# EAGLE design CC2-64K-EPROM-CARTRIDGE-2012-V1RA (EAGLE 5.10)
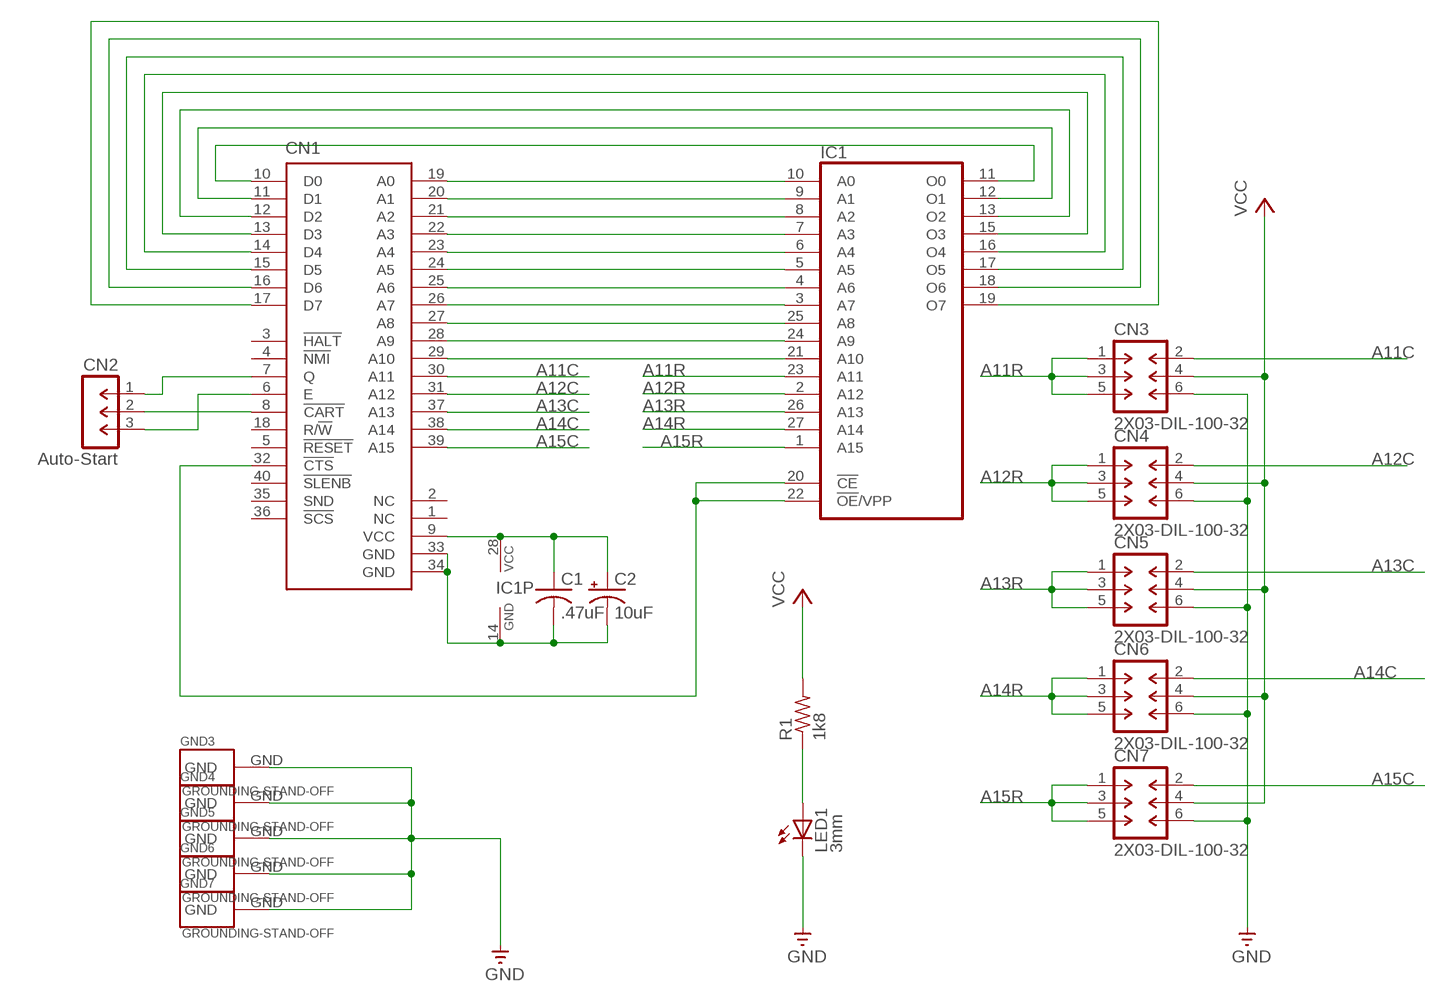
[diagram p0: schematic, sheet 1]

## Parts
C1  .47uF  NP-CAPACITOR-C050-025X075  [C050-025X075]
C2  10uF  P-CAPACITOR-CPOL-RADIAL-1  [CPOL-RADIAL-1]
CN1  COCO3-CARTRIDGE-PLUG-MEDIUM  [EDGE-CARD-PLUG-40-MEDIUM]
CN2  Auto-Start  1X03-SIP-100-32  [SIL1X03-100]
CN3  2X03-DIL-100-32  [DIL2X03-100]
CN4  2X03-DIL-100-32  [DIL2X03-100]
CN5  2X03-DIL-100-32  [DIL2X03-100]
CN6  2X03-DIL-100-32  [DIL2X03-100]
CN7  2X03-DIL-100-32  [DIL2X03-100]
GND3  GROUNDING-STAND-OFF  [STAND-OFF]
GND4  GROUNDING-STAND-OFF  [STAND-OFF]
GND5  GROUNDING-STAND-OFF  [STAND-OFF]
GND6  GROUNDING-STAND-OFF  [STAND-OFF]
GND7  GROUNDING-STAND-OFF  [STAND-OFF]
IC1  27C512D  [DIL28-6]
LED1  3mm  LED3MM  [LED3MM]
R1  1k8  RESISTOR  [0207/10]

## Nets
!CART: CN1.8(!CART) CN2.2
A11C: CN1.30(A11) CN3.2
A11R: CN3.1 CN3.3 CN3.5 IC1.23(A11)
A12C: CN1.31(A12) CN4.2
A12R: CN4.1 CN4.3 CN4.5 IC1.2(A12)
A13C: CN1.37(A13) CN5.2
A13R: CN5.1 CN5.3 CN5.5 IC1.26(A13)
A14C: CN1.38(A14) CN6.2
A14R: CN6.1 CN6.3 CN6.5 IC1.27(A14)
A15C: CN1.39(A15) CN7.2
A15R: CN7.1 CN7.3 CN7.5 IC1.1(A15)
E: CN1.6(E) CN2.3
GND [power]: C1.2(-) C2.2(-) CN1.33(GND) CN1.34(GND) CN3.6 CN4.6 CN5.6 CN6.6 CN7.6 GND3.GND GND4.GND GND5.GND GND6.GND GND7.GND IC1.14(GND) LED1.K(C)
N$1: CN1.19(A0) IC1.10(A0)
N$2: CN1.20(A1) IC1.9(A1)
N$3: CN1.21(A2) IC1.8(A2)
N$4: CN1.22(A3) IC1.7(A3)
N$5: CN1.23(A4) IC1.6(A4)
N$6: CN1.24(A5) IC1.5(A5)
N$7: CN1.25(A6) IC1.4(A6)
N$8: CN1.26(A7) IC1.3(A7)
N$9: CN1.27(A8) IC1.25(A8)
N$10: CN1.28(A9) IC1.24(A9)
N$11: CN1.29(A10) IC1.21(A10)
N$12: CN1.10(D0) IC1.11(O0)
N$13: CN1.11(D1) IC1.12(O1)
N$14: CN1.12(D2) IC1.13(O2)
N$15: CN1.13(D3) IC1.15(O3)
N$16: CN1.14(D4) IC1.16(O4)
N$17: CN1.15(D5) IC1.17(O5)
N$18: CN1.16(D6) IC1.18(O6)
N$19: CN1.17(D7) IC1.19(O7)
N$23: CN1.32(!CTS) IC1.20(!CE) IC1.22(!OE!/VPP)
N$24: LED1.A R1.1
Q: CN1.7(Q) CN2.1
VCC [power]: C1.1(+) C2.1(+) CN1.9(VCC) CN3.4 CN4.4 CN5.4 CN6.4 CN7.4 IC1.28(VCC) R1.2
Unconnected: CN1.1(NC) CN1.2(NC) CN1.3(!HALT) CN1.4(!NMI) CN1.5(!RESET) CN1.18(R/!W) CN1.35(SND) CN1.36(!SCS) CN1.40(!SLENB)

## Library data of the parts
C1 = GIMEchip-Capacitor:NP-CAPACITOR: NON-POLARIZED CAPACITOR grid 5mm
C2 = GIMEchip-Capacitor:P-CAPACITOR: POLARIZED CAPACITOR Small Radial Electrolytic
CN1 = GIMEchip-TRS-80-CoCo-3-Program-Pak-Cartridge:COCO3-CARTRIDGE-PLUG: CoCo 3 Program Pak Cartridge Plug - http://www.GIMEchip.com/ Tandy Radio Shack TRS-80 Color Computer 3 Program Pak Cartridge Plug (Edge-Card) E.A.G.L.E. Library Part created by John Eric Turner & His Father - sales@gimechip.com <mailto:sales@gimechip.com?subject=Tandy Radio Shack TRS- 80 Color Computer 3 Program Pak Cartridge Plug (Edge-Card) E.A.G.L.E. Library Part> 40-Pin Edge-Card sharing the same pinout as the Program Pak Cartridge Edge-Card Connector. This library part has been designed to provide a 40-pin cartridge plug connector matching the CoCo's Edge-Card connector (Cartridge Slot). This library part is also useful with the Dragon and other CoCo clones. It is important to note that the CoCo 2 & 3 only provide +5V at the cartridge connector. The CoCo 1 provides +5V AND +/-12V at the cartridge connector. The Dragon provides only +5V and +12V at the cartridge connector. The table below lists all similarities and differences between these machines, relevant to the cartridge slot: PIN # TRS-80 "CoCo 1" Function Tano/Dragon Data "Dragon 32/64" Function TRS-80 "CoCo 2 & 3" Function 1 -12V +12V NC 2 +12V +12V NC 3 HALT* HALT* HALT* 4 NMI* NMI* NMI* 5 RESET* RESET* RESET* 6 E E E 7 Q Q Q 8 CART* CART* CART* 9 +5V +5V +5V 10 D0 D0 D0 11 D1 D1 D1 12 D2 D2 D2 13 D3 D3 D3 14 D4 D4 D4 15 D5 D5 D5 16 D6 D6 D6 17 D7 D7 D7 18 R/W* R/W* R/W* 19 A0 A0 A0 20 A1 A1 A1 21 A2 A2 A2 22 A3 A3 A3 23 A4 A4 A4 24 A5 A5 A5 25 A6 A6 A6 26 A7 A7 A7 27 A8 A8 A8 28 A9 A9 A9 29 A10 A10 A10 30 A11 A11 A11 31 A12 A12 A12 32 CTS* CSEL* CTS* 33 GND GND GND 34 GND GND GND 35 SND SND SND 36 SCS* P2* SCS* 37 A13 A13 A13 38 A14 A14 A14 39 A15 A15 A15 40 SLENB* DSD* SLENB*
CN2 = GIMEchip-Header-Generic:1X03: MALE HEADER
CN3-CN7 = GIMEchip-Header-Generic:2X03: MALE HEADER
GND3-GND7 = GIMEchip-Grounding:GROUNDING
IC1 = GIMEchip-EPROM:27C512D: MEMORY
LED1 = Copy of GCC-CC3-512KCBR-0001:LED3MM: LED T1 (3 mm)
R1 = GIMEchip-Resistor:RESISTOR

## Net classes
0 default: width 0.254 mm, clearance 0.203 mm
1 power: width 0.635 mm, clearance 0.203 mm

## Board
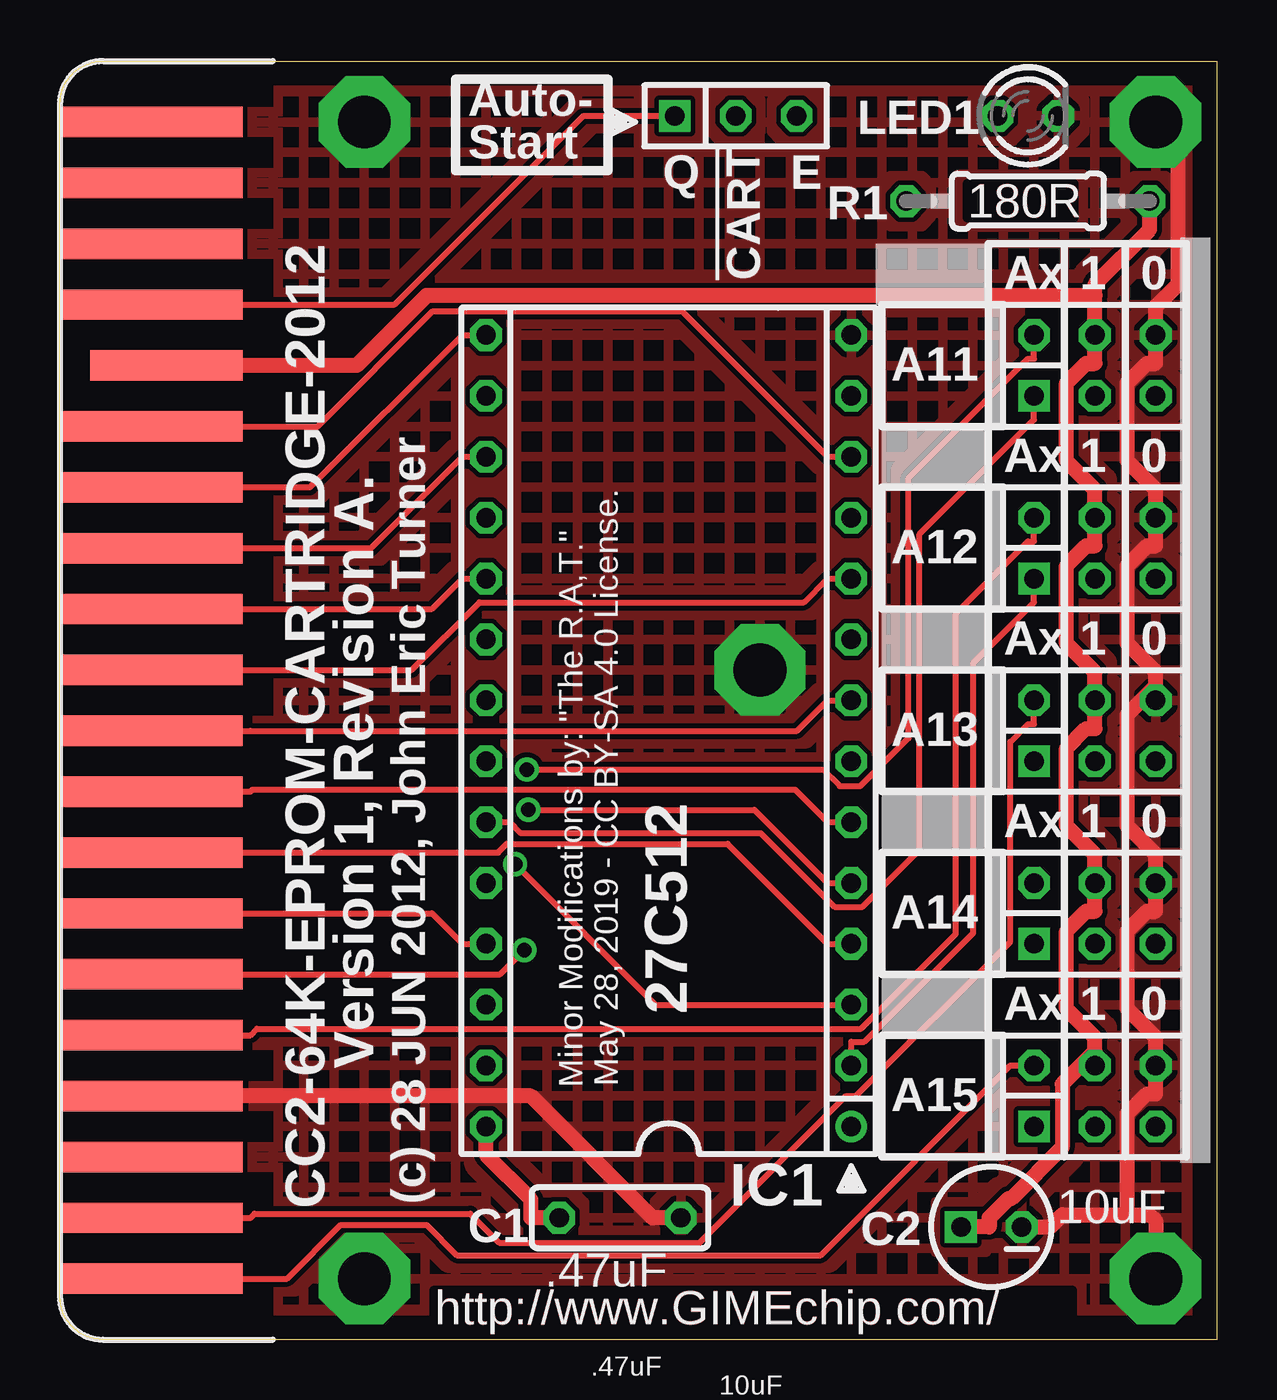
[diagram p1: board, top side]
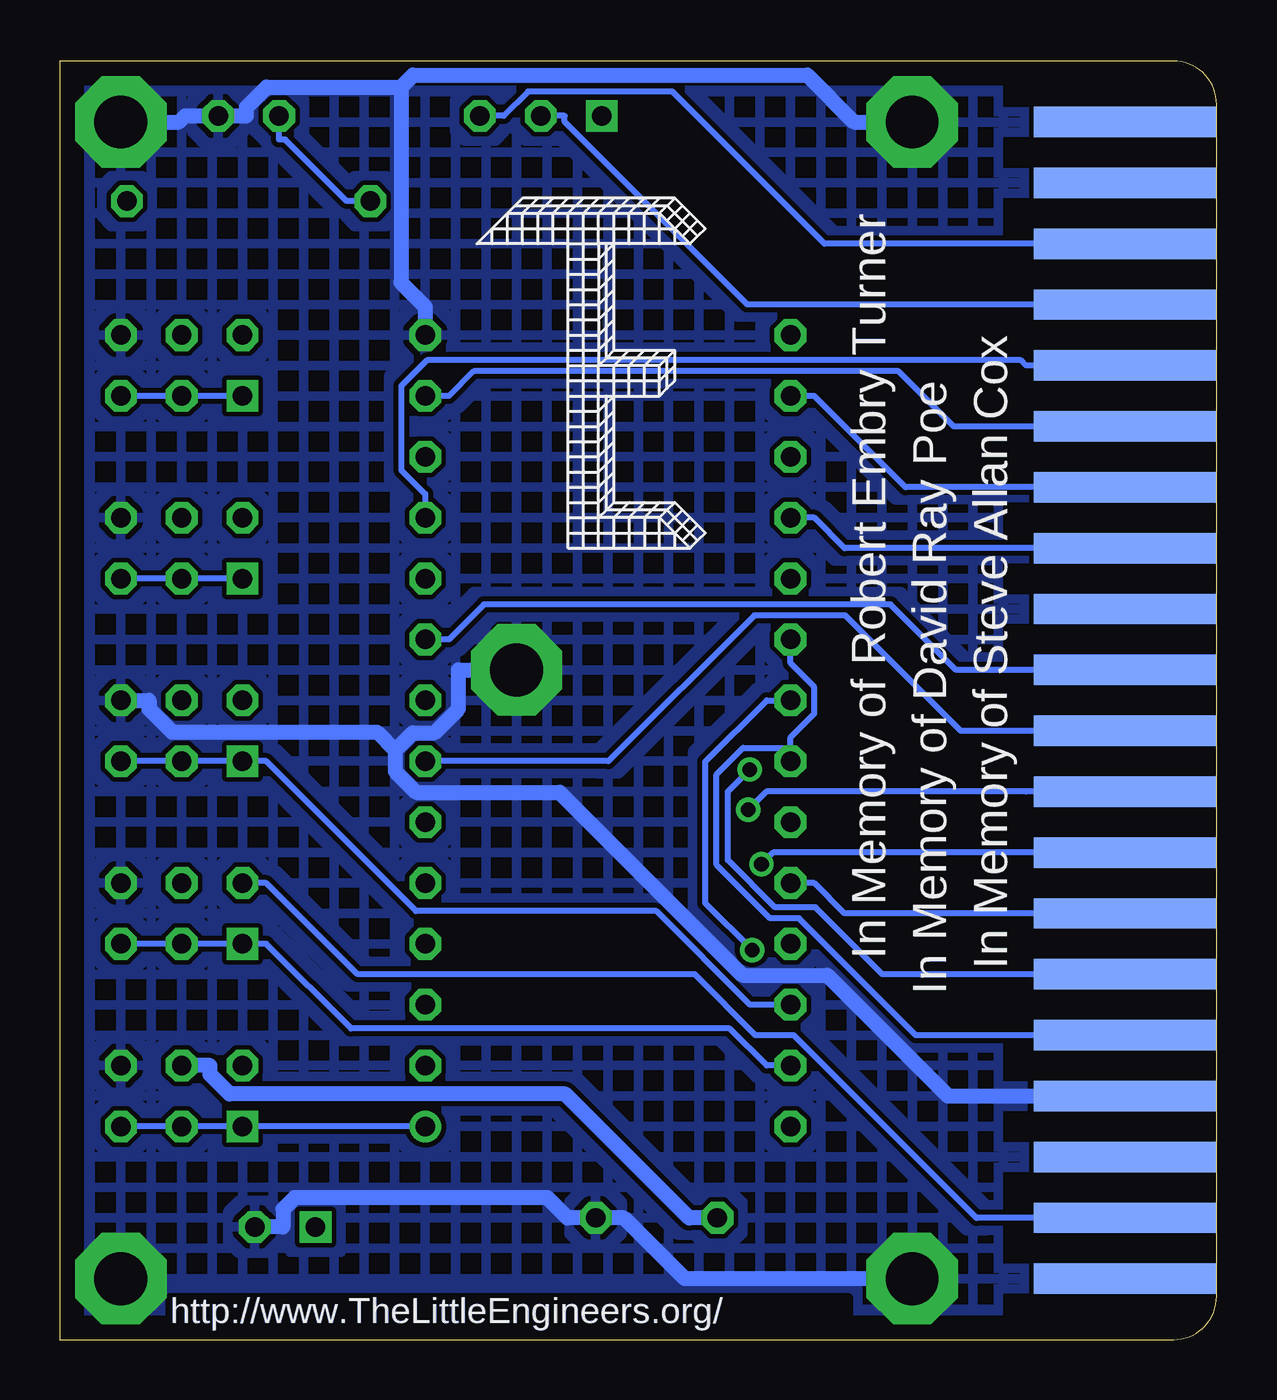
[diagram p2: board, bottom side, seen from below]

Size 48.26 x 53.34 mm. Coordinates in mm from the lower left corner, seen from the top.
Outline: 48.26,53.34 48.26,0 1.8,0 arc-90 0,1.8 0,51.54 arc-90 1.8,53.34 48.26,53.34
Copper layers (1*16): Top 0.035mm / dielectric 1.5mm / Bottom 0.035mm
Design rules "default": minimum track width 10mil, minimum drill 24mil, track to track 8mil, track to pad 8mil, pad to pad 8mil, via to via 8mil, smd to smd 8mil, copper to edge 40mil, drill to drill 8mil, minimum pad ring 10mil, minimum via ring 8mil, stop-mask expansion 4mil, vias tented up to drill 0mil, thermal gap 10mil
vRestrict: area 8.9,5.1 to 16.5,48.3

### Footprints (pad centres in the part's own frame; a part is rotated, then mirrored left to right if it is on the bottom)
C050-025X075 = drill 0.813 octagon: 1 -2.54,0; 2 2.54,0
CPOL-RADIAL-1 = drill 0.813 square: 1 1.27,0 | drill 0.813 octagon: 2 -1.27,0
EDGE-CARD-PLUG-40-MEDIUM = smd 7.62 x 1.27: 1 3.81,24.13; 3 3.81,21.59; 5 3.81,19.05; 7 3.81,16.51; 11 3.81,11.43; 13 3.81,8.89; 15 3.81,6.35; 17 3.81,3.81; 19 3.81,1.27; 21 3.81,-1.27; 23 3.81,-3.81; 25 3.81,-6.35; 27 3.81,-8.89; 29 3.81,-11.43; 31 3.81,-13.97; 33 3.81,-16.51; 35 3.81,-19.05; 37 3.81,-21.59; 39 3.81,-24.13 | smd 7.62 x 1.27 bottom: 2 3.81,24.13; 4 3.81,21.59; 6 3.81,19.05; 8 3.81,16.51; 10 3.81,13.97; 12 3.81,11.43; 14 3.81,8.89; 16 3.81,6.35; 18 3.81,3.81; 20 3.81,1.27; 22 3.81,-1.27; 24 3.81,-3.81; 26 3.81,-6.35; 28 3.81,-8.89; 30 3.81,-11.43; 32 3.81,-13.97; 34 3.81,-16.51; 36 3.81,-19.05; 38 3.81,-21.59; 40 3.81,-24.13 | smd 6.35 x 1.27: 9 4.445,13.97
SIL1X03-100 = drill 0.813 square: 1 -2.54,0 | drill 0.813 octagon: 2 0,0; 3 2.54,0
DIL2X03-100 = drill 0.813 square: 1 -2.54,-1.27 | drill 0.813 octagon: 2 -2.54,1.27; 3 0,-1.27; 4 0,1.27; 5 2.54,-1.27; 6 2.54,1.27
STAND-OFF = drill 2.2 pad 3.81 octagon: GND 0,0
DIL28-6 = drill 0.813 round: 1 -16.51,-7.62 | drill 0.813 octagon: 2 -13.97,-7.62; 3 -11.43,-7.62; 4 -8.89,-7.62; 5 -6.35,-7.62; 6 -3.81,-7.62; 7 -1.27,-7.62; 8 1.27,-7.62; 9 3.81,-7.62; 10 6.35,-7.62; 11 8.89,-7.62; 12 11.43,-7.62; 13 13.97,-7.62; 14 16.51,-7.62; 15 16.51,7.62; 16 13.97,7.62; 17 11.43,7.62; 18 8.89,7.62; 19 6.35,7.62; 20 3.81,7.62; 21 1.27,7.62; 22 -1.27,7.62; 23 -3.81,7.62; 24 -6.35,7.62; 25 -8.89,7.62; 26 -11.43,7.62; 27 -13.97,7.62; 28 -16.51,7.62
LED3MM = drill 0.813 octagon: A -1.27,0; K 1.27,0
0207/10 = drill 0.813 octagon: 1 -5.08,0; 2 5.08,0

### Placement (x,y rotation side)
C1  23.37,5.08 0 top
C2  38.86,4.7 180 top
CN1  0,26.67 0 top
CN2  28.19,51.05 0 top
CN3  43.18,40.64 0 top
CN4  43.18,33.02 0 top
CN5  43.18,25.4 0 top
CN6  43.18,17.78 0 top
CN7  43.18,10.16 0 top
GND3  12.7,50.8 0 top
GND4  12.7,2.54 0 top
GND5  45.72,50.8 0 top
GND6  45.72,2.54 0 top
GND7  29.21,27.94 0 top
IC1  25.4,25.4 90 top
LED1  40.39,51.05 0 top
R1  40.39,47.5 0 top
U$1  [TLE-LOGO-10]  30.86,33.02 0 bottom

### Tracks (layer width: path | path; a pad name or v marks a point on that pad's centre or on a via)
!CART
  Bottom 0.254: CN2.2 27.2,51.05 27.2,50.81 19.58,43.18 CN1.8
A11C  (via drill 0.61 pad 1.02)
  Top 0.254: v19.48,23.78 31.84,23.78 32.54,23.09 33.4,23.09 35.41,25.1 35.41,35.93 40.39,40.92 40.64,40.92 CN3.2
  Bottom 0.254: v19.48,23.78 20.39,22.87 20.39,20.01 18.42,18.03 16.73,18.03 13.93,15.24 CN1.30
A11R
  Top 0.254: CN3.1 40.64,38.38 35.86,33.6 35.86,20.43 33.49,18.05 32.32,18.05 29.24,21.14 19.22,21.14 18.77,21.59 IC1.23
  Bottom 0.254: CN3.1 CN3.3 CN3.5
A12C
  Top 0.254: CN1.31 7.95,12.7 8.22,12.97 33.42,12.97 37.38,16.92 37.38,30.29 40.39,33.3 40.64,33.3 CN4.2
A12R
  Top 0.254: CN4.1 40.64,30.76 38.11,28.23 38.11,16.97 33.56,12.42 33.02,12.42 IC1.2
  Bottom 0.254: CN4.1 CN4.3 CN4.5
A13C
  Top 0.254: CN1.37 7.95,5.08 8.12,5.25 17.12,5.25 18.32,4.04 26.68,4.04 32.8,10.16 33.21,10.16 39.65,16.6 39.65,24.94 40.39,25.68 40.64,25.68 CN5.2
A13R
  Bottom 0.254: IC1.26 18.77,13.97 19.47,13.97 23.38,17.88 33.4,17.88 39.65,24.13 CN5.1 CN5.3 CN5.5
A14C
  Bottom 0.254: CN6.2 39.65,19.05 35.84,15.24 21.77,15.24 19.23,12.7 17.64,12.7 10.02,5.08 CN1.38
A14R
  Bottom 0.254: IC1.27 18.77,11.43 20.32,12.98 36.12,12.98 39.65,16.51 CN6.1 CN6.3 CN6.5
A15C
  Top 0.254: CN7.2 39.65,11.43 31.74,3.52 16.56,3.52 15.3,4.78 11.72,4.78 9.48,2.54 CN1.39
A15R
  Bottom 0.254: CN7.5 CN7.3 CN7.1 IC1.1
E
  Bottom 0.254: CN2.3 29.74,51.05 28.73,52.07 22.7,52.07 16.36,45.72 CN1.6
GND
  Top 0.635: GND5.GND 46.66,49.86 46.66,44.03 45.72,43.09 CN3.6 45.72,40.73 45.35,40.73 44.53,39.91 44.53,36.66 45.72,35.47 CN4.6 45.72,33.7 45.72,33.11 45.35,33.11 44.53,32.29 44.53,29.04 45.72,27.85 45.72,27.26 | 44.53,5.21 41.83,5.21 41.31,4.7 C2.2 | 44.53,5.21 45.47,5.21 45.72,4.97 GND6.GND | 44.53,5.21 44.53,9.43 45.35,10.25 45.72,10.25 45.72,10.84 CN7.6 45.72,12.61 44.53,13.8 44.53,17.05 45.35,17.87 45.72,17.87 CN6.6 45.72,20.23 44.53,21.42 44.53,26.07 45.72,27.26 | 45.72,27.26 CN5.6 | C1.2 24.73,5.08 19.65,10.16 CN1.34
  Bottom 0.635: CN1.34 11.2,10.16 16.24,15.2 19.78,15.2 27.41,22.83 33.4,22.83 34.27,23.7 34.27,24.58 | C2.2 38.95,4.7 38.95,5.44 38.47,5.91 27.93,5.91 27.09,5.08 C1.2 24.73,5.08 22.19,2.54 GND4.GND | 34.03,52.26 34.03,44.1 33.02,43.09 IC1.14 | 34.03,52.26 33.53,52.75 17.08,52.75 15.13,50.8 GND3.GND | 34.03,52.26 39.64,52.26 40.47,51.42 40.47,51.05 LED1.K 43.04,51.05 43.29,50.8 GND5.GND | 34.27,24.58 33.54,25.31 32.64,25.31 31.64,26.31 31.64,27.94 GND7.GND | 34.27,24.58 35.03,25.34 43.58,25.34 44.54,26.3 44.54,26.67 CN5.6
  pour Top (hatched): 0,53.34 48.26,53.34 48.26,0 0,0
  pour Bottom (hatched): 0,53.34 48.26,53.34 48.26,0 0,0
N$1
  Top 0.254: CN1.19 14.68,27.94 17.5,30.76 31.04,30.76 32.03,31.75 IC1.10
N$2
  Bottom 0.254: IC1.9 32.03,29.21 30.56,30.67 13.61,30.67 10.87,27.94 CN1.20
N$3
  Top 0.254: CN1.21 7.95,25.4 30.76,25.4 32.03,26.67 IC1.8
N$4
  Bottom 0.254: IC1.7 25.37,24.13 19.29,30.22 15.49,30.22 10.67,25.4 CN1.22
N$5
  Top 0.254: CN1.23 7.95,22.86 8.04,22.94 30.68,22.94 32.03,21.59 IC1.6
N$6  (via drill 0.61 pad 1.02)
  Top 0.254: v19.54,22.11 28.97,22.11 32.03,19.05 IC1.5
  Bottom 0.254: v19.54,22.11 18.79,22.86 7.95,22.86 CN1.24
N$7
  Top 0.254: CN1.25 7.95,20.32 18.28,20.32 18.64,20.68 27.86,20.68 32.03,16.51 IC1.4
N$8  (via drill 0.61 pad 1.02)
  Top 0.254: IC1.3 24.86,13.97 v18.99,19.84
  Bottom 0.254: CN1.26 18.51,20.32 v18.99,19.84
N$9
  Top 0.254: IC1.25 16.79,16.51 15.52,17.78 CN1.27
N$10
  Bottom 0.254: IC1.24 16.79,19.05 15.52,17.78 CN1.28
N$11  (via drill 0.61 pad 1.02)
  Top 0.254: CN1.29 18.37,15.24 v19.38,16.25
  Bottom 0.254: v19.38,16.25 21.33,18.2 21.33,24.11 18.77,26.67 IC1.21
N$12
  Bottom 0.254: CN1.10 7.95,40.64 8.17,40.86 32.94,40.86 34.02,39.79 34.02,36.28 33.02,35.28 IC1.11
N$13
  Top 0.254: IC1.12 32.03,36.83 25.96,42.9 15.56,42.9 10.76,38.1 CN1.11
N$14
  Bottom 0.254: CN1.12 10.97,38.1 13.27,40.4 31,40.4 32.03,39.37 IC1.13
N$15
  Top 0.254: IC1.15 16.79,41.91 10.44,35.56 CN1.13
N$16
  Bottom 0.254: IC1.16 16.79,39.37 12.98,35.56 CN1.14
N$17
  Top 0.254: IC1.17 16.79,36.83 12.98,33.02 CN1.15
N$18
  Bottom 0.254: IC1.18 16.79,34.29 15.52,33.02 CN1.16
N$19
  Top 0.254: IC1.19 16.79,31.75 15.52,30.48 CN1.17
N$23
  Bottom 0.254: 17.78,24.69 19.76,24.69 20.86,23.59 20.86,19.81 18.63,17.58 17.43,17.58 12.55,12.7 CN1.32 | 17.78,24.69 17.78,25.12 16.78,26.12 16.78,27.22 17.78,28.22 IC1.20 | 17.78,24.69 IC1.22
N$24
  Bottom 0.254: LED1.A 39.12,50.06 38.86,50.06 36.3,47.5 R1.1
Q
  Top 0.254: CN1.7 13.97,43.18 21.85,51.05 CN2.1
VCC
  Top 0.635: 43.18,43.56 43.18,44.03 45.47,46.32 R1.2 | 43.18,43.56 CN3.4 43.18,40.73 42.81,40.73 41.99,39.91 41.99,36.66 43.18,35.47 CN4.4 43.18,33.11 42.81,33.11 41.99,32.29 41.99,29.04 43.18,27.85 CN5.4 43.18,26.08 43.18,25.49 42.81,25.49 41.99,24.67 41.99,21.42 43.18,20.23 CN6.4 43.18,18.46 43.18,17.87 42.81,17.87 41.99,17.05 41.99,13.8 43.18,12.61 43.18,12.02 | 43.18,43.56 15.3,43.56 12.38,40.64 CN1.9 | C2.1 38.77,4.7 38.77,5.08 39.57,5.88 39.69,5.88 41.82,8.01 41.82,10.66 43.18,12.02 | CN7.4 43.18,12.02 | C1.1 19.65,5.08 19.65,5.84 17.78,7.71 IC1.28
  Bottom 0.635: C1.1 22.01,5.08 27.18,10.25 41.19,10.25 42,11.06 42,11.43 CN7.4

### Text on the board
Top: 180R | http://www.GIMEchip.com/
Bottom: http://www.TheLittleEngineers.org/
tPlace: 180R | Minor Modifications by: "The R.A,T." | May 28, 2019 - CC BY-SA 4.0 License. | 10uF | .47uF
bPlace: In Memory of Robert Embry Turner | In Memory of Steve Allan Cox | In Memory of David Ray Poe | http://www.TheLittleEngineers.org/
tNames: Auto- | LED1 | Start | Q | E | R1 | IC1 | !CART | 1K8 | Ax | 1 | 0 | R1 | A11 | Ax | 1 | 0 | CN5 | CN6 | CN3 | CN4 | CN7 | A12 | GND5 | C2 | LED1 | C1 | CN2 | GND3 | GND6 | GND7 | (c) 2012 | Turner | John | Eric | GND4 | Ax | 1 | 0 | A13 | Ax | 1 | 0 | A14 | 27C512 | Ax | 1 | 0 | Version 1, Revision A. | A15 | CC2-64K-EPROM-CARTRIDGE-2012 | IC1 | (c) 28 JUN 2012, John Eric Turner | C1 | C2 | http://www.GIMEchip.com/ | .47uF | 10uF